# EasyEDA Pro project ProDoc_Schematic_Edge_Nexus_2026-03-18.epro

# Schematic Schematic Edge Nexus
Board Name: Board1; Create Date: 2026-02-27; Page Name: P1; Project Name: Edge Nexus; Schematic Name: Schematic Edge Nexus; Update Date: 2026-02-27; Company: EasyEDA.com; Page Size: A4; Version: V1.0
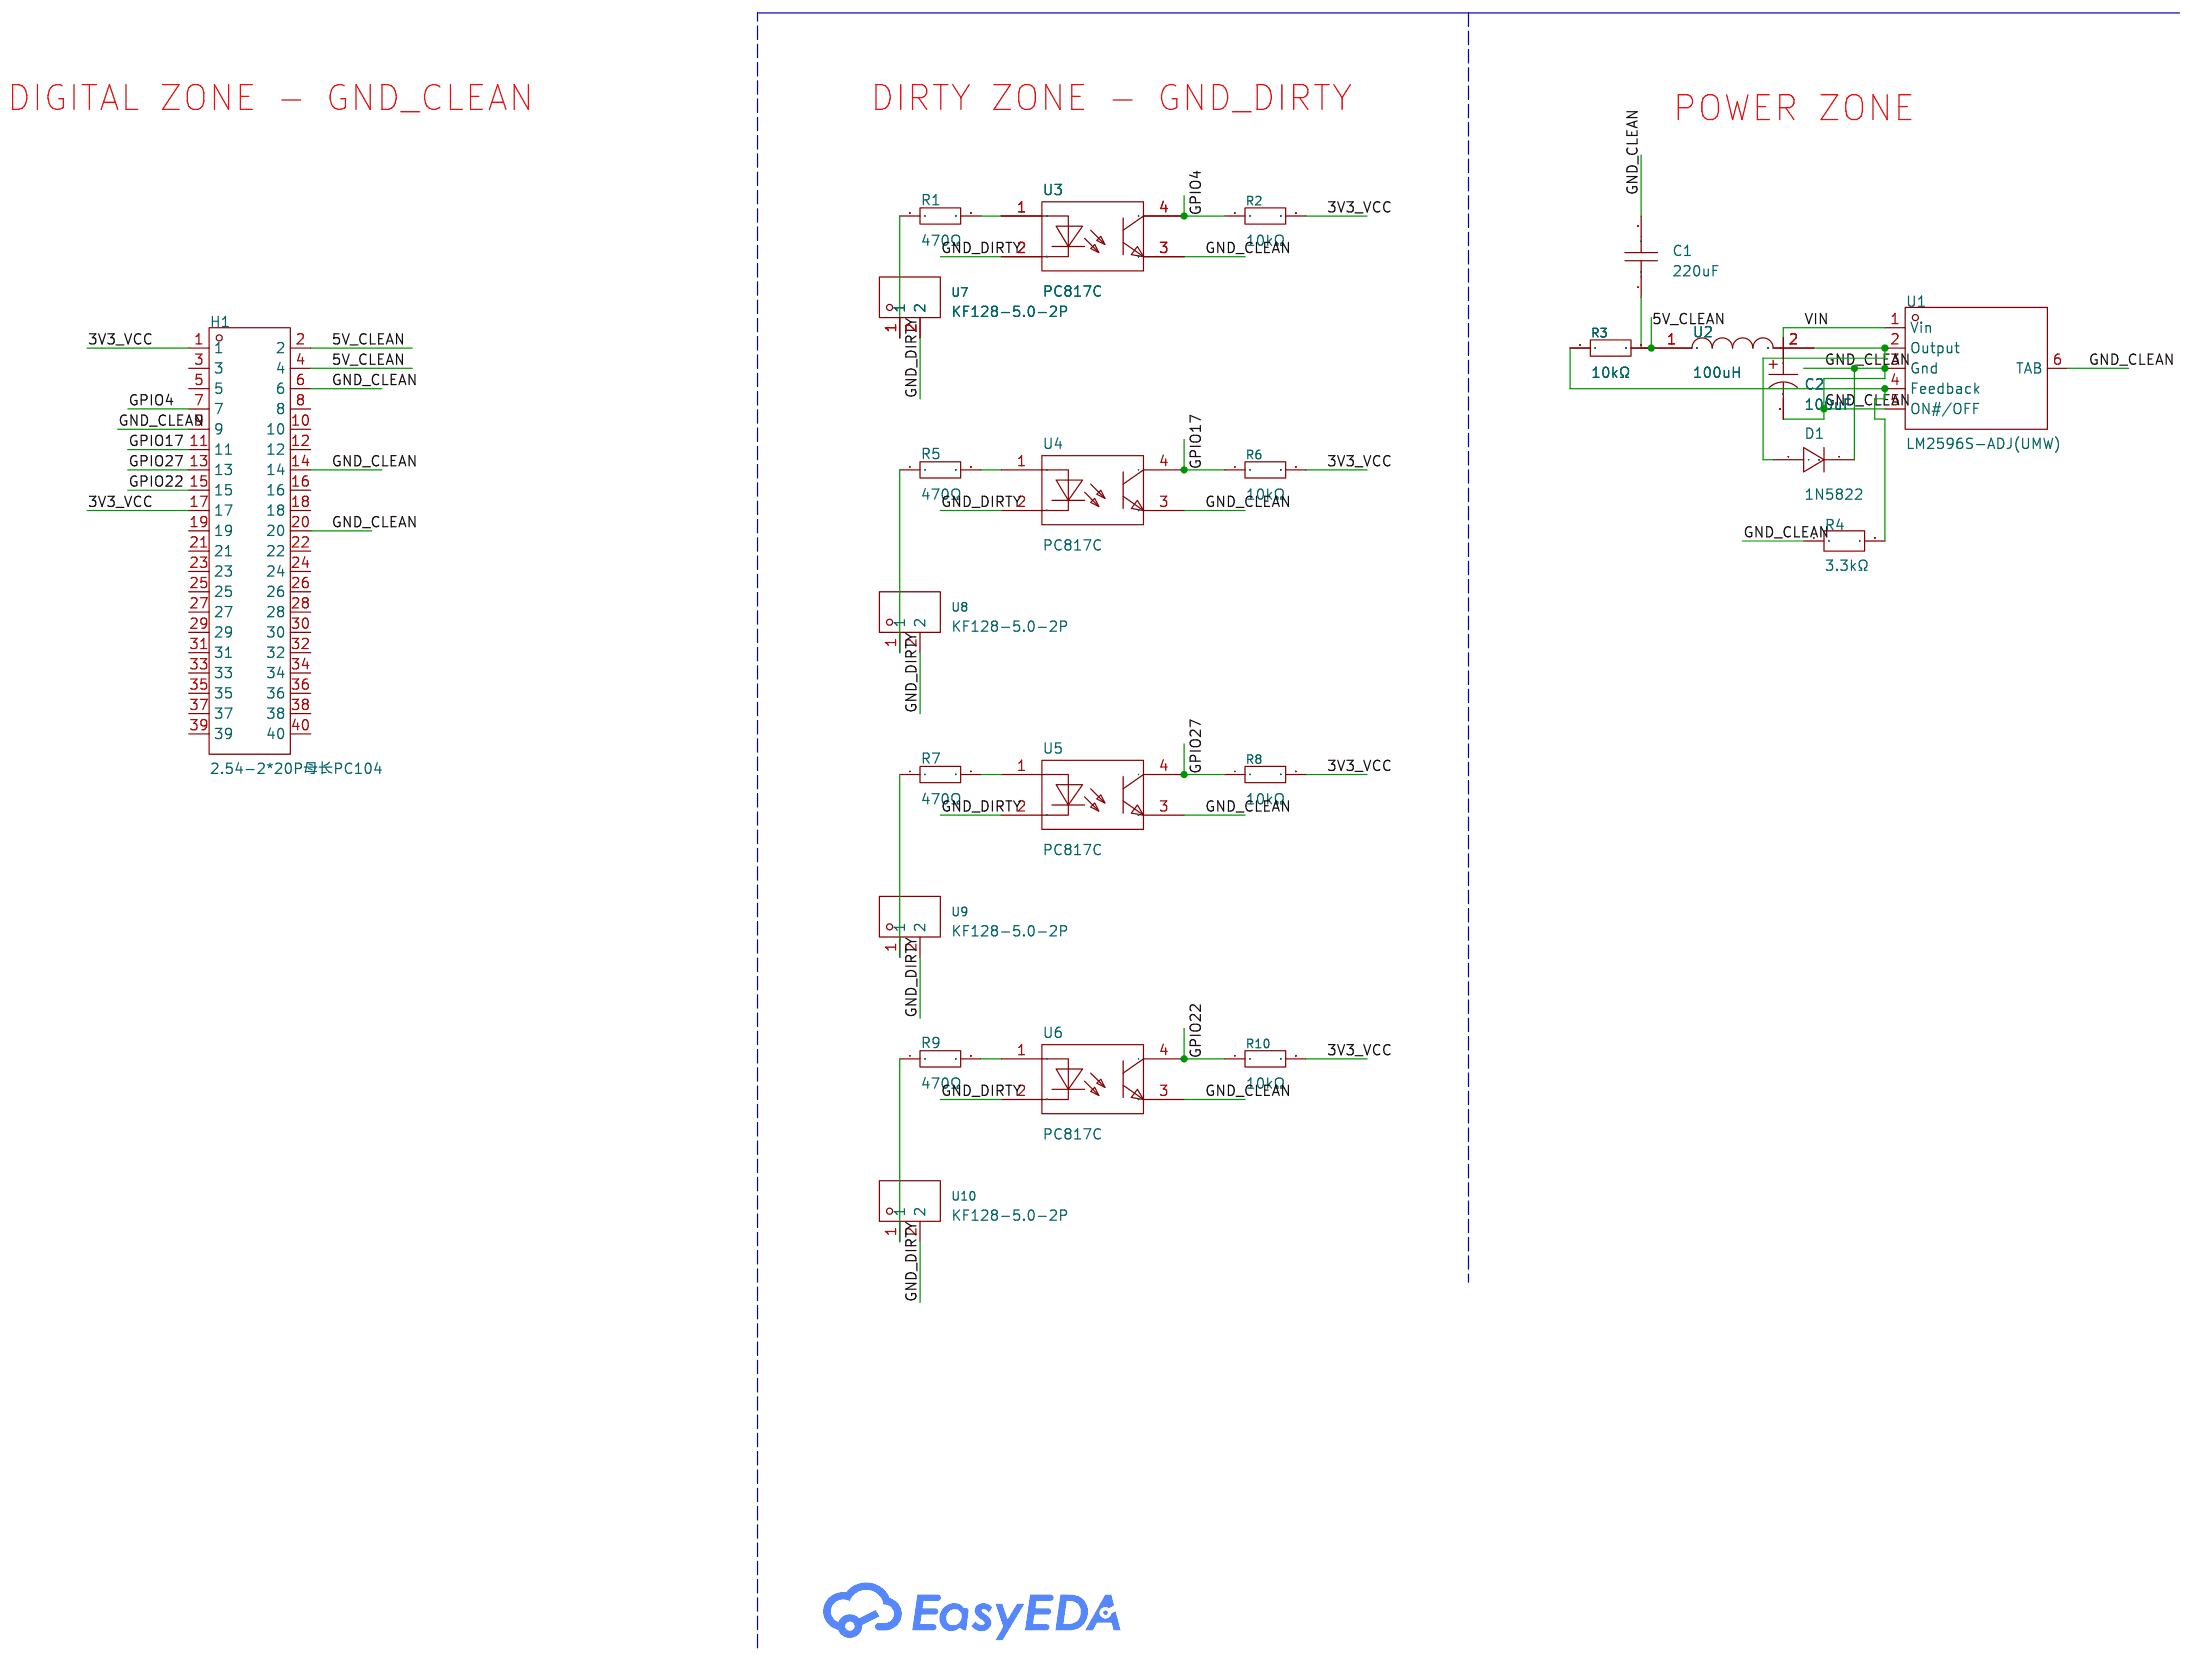
[diagram p0: schematic sheet]

## Parts
C1  220uF  [C1210]
C2  100uF  [CAP-TH_BD8.0-P3.50-D0.6-FD-H10.0]
D1  1N5822  [DO-201AD_BD5.3-L8.4-P12.50-D1.4-RD]
H1  2.54-2*20P母长PC104  [HDR-TH_40P-P2.54-V-F-R2-C20-S2.54-2]
R1  470Ω  [R0402]
R2  10kΩ  [R0402]
R3  10kΩ  [R0402]
R4  3.3kΩ  [RES-TH_BD4.5-L11.5-P15.50-D0.8]
R5  470Ω  [R0402]
R6  10kΩ  [R0402]
R7  470Ω  [R0402]
R8  10kΩ  [R0402]
R9  470Ω  [R0402]
R10  10kΩ  [R0402]
U1  LM2596S-ADJ(UMW)  [TO-263-5_L10.2-W8.9-P1.70-BR]
U2  100uH  [IND-SMD_L12.3-W12.3]
U3  PC817C  [OPTO-SMD-4_L4.6-W6.5-P2.54-LS10.3-TL]
U4  PC817C  [OPTO-SMD-4_L4.6-W6.5-P2.54-LS10.3-TL]
U5  PC817C  [OPTO-SMD-4_L4.6-W6.5-P2.54-LS10.3-TL]
U6  PC817C  [OPTO-SMD-4_L4.6-W6.5-P2.54-LS10.3-TL]
U7  KF128-5.0-2P  [CONN-TH_P5.00_KF128-5.0-2P]
U8  KF128-5.0-2P  [CONN-TH_P5.00_KF128-5.0-2P]
U9  KF128-5.0-2P  [CONN-TH_P5.00_KF128-5.0-2P]
U10  KF128-5.0-2P  [CONN-TH_P5.00_KF128-5.0-2P]

## Library data of the parts
C1 = CL32A227MQVNNNE: Capacitance:220uF Tolerance:±20% Tolerance:±20% Voltage Rating:6.3V Temperature Coefficient:X5R; LCSC Part Name: 220uF ±20% 6.3V; Supplier Part: C400951; Manufacturer: SAMSUNG(三星); Supplier Footprint: 1210; JLCPCB Part Class: Extended Part; Datasheet: https://item.szlcsc.com/datasheet/CL32A227MQVNNNE/385441.html; Supplier: LCSC; Tolerance: ±20%; Voltage Rating: 6.3V; Temperature Coefficient: X5R
C2 = 100uF35V8x11GF: Capacitance:100uF Tolerance:±20% Tolerance:±20% Voltage Rating:35V Ripple Current:640mA@100KHz Equivalent Series Resistance(ESR):170mΩ Pin Spacing:3.5mm Diameter:8mm Height - Seated (Max):11mm Lifetime:3000hrs@105℃ Operating Temperature:-40℃~+105℃ Operati; LCSC Part Name: 100uF ±20% 35V; Supplier Part: C49304899; Manufacturer: Econd(米朗电子); Supplier Footprint: 插件,D8xL11mm; JLCPCB Part Class: Extended Part; Datasheet: https://item.szlcsc.com/datasheet/100uF35V8x11GF/51766727.html; Supplier: LCSC; Tolerance: ±20%; Voltage Rating: 35V; Ripple Current: 640mA@100KHz; Equivalent Series Resistance(ESR): 170mΩ; Pin Spacing: 3.5mm; Diameter: 8mm; Height - Seated (Max): 11mm; Lifetime: 3000hrs@105℃; Operating Temperature: -40℃~+105℃
D1 = 1N5822_C82806: Diode Configuration:1 Independent Voltage - Forward(Vf@If):530mV Voltage - DC Reverse(Vr):40V Current - Rectified:3A Reverse Leakage Current (Ir):2mA@40V Operating Junction Temperature Range:-40℃~+125℃ Operating Junction Temperature Range:-40℃~+125℃ Non-R; LCSC Part Name: 电压:40V 电流:3A; Supplier Part: C82806; Manufacturer: LRC(乐山无线电); Supplier Footprint: DO-201AD; JLCPCB Part Class: Extended Part; Datasheet: https://item.szlcsc.com/datasheet/1N5822/83966.html; Supplier: LCSC; Diode Configuration: 1 Independent; Voltage - Forward(Vf@If): 530mV; Voltage - DC Reverse(Vr): 40V; Current - Rectified: 3A; Reverse Leakage Current (Ir): 2mA@40V; Operating Junction Temperature Range: -40℃~+125℃; Non-Repetitive Peak Forward Surge Current: 80A
H1 = 2.54-2*20P母长PC104: Holes Structure:2x20P Pitch:2.54mm Row Spacing:2.54mm Circular Hole / Square Hole:Square Hole Mounting Type:Through Hole Number of Rows:2 Number of Positions:40P Current Rating:3A Holes Direction:Top Insulation Height:8.3mm Contact Material:Brass Contact; LCSC Part Name: 2x20P 间距:2.54mm 直插; Supplier Part: C35165; Manufacturer: BOOMELE(博穆精密); Supplier Footprint: 插件,P=2.54mm; Datasheet: https://item.szlcsc.com/datasheet/2.54-2*20P%25E6%25AF%258D%25E9%2595%25BFPC104/36136.html; Supplier: LCSC; Holes Structure: 2x20P; Pitch: 2.54mm; Row Spacing: 2.54mm; Circular Hole / Square Hole: Square Hole; Mounting Type: Through Hole; Number of Rows: 2; Number of Positions: 40P; Current Rating: 3A; Holes Direction: Top; Insulation Height: 8.3mm; Contact Material: Brass; PIN Length: 12.3mm
R1 R5 R7 R9 = RC0402JR-07470RL: Type:Thick Film Resistors Resistance: Tolerance:±5% Tolerance:±5% Power(Watts): Overload Voltage (Max): Temperature Coefficient:±100ppm/℃ Temperature Coefficient:±100ppm/℃ Operating Temperature Range:-55℃~+155℃ Operating Temperature Range:-55℃~+155℃; LCSC Part Name: 厚膜电阻 470Ω ±5% 62.5mW; Supplier Part: C114949; Manufacturer: YAGEO(国巨); Supplier Footprint: 0402; Datasheet: https://atta.szlcsc.com/upload/public/pdf/source/20180821/C275644_0D56F95EFF785E7D9A1FEF436B37DA78.pdf; Supplier: LCSC; Type: Thick Film Resistors; Tolerance: ±5%; Temperature Coefficient: ±100ppm/℃; Operating Temperature Range: -55℃~+155℃
R2 R3 R6 R8 R10 = TR0402D10K0Q1025Z: Type:Thin Film Resistor Resistance: Tolerance:±0.5% Tolerance:±0.5% Power(Watts): Overload Voltage (Max): Temperature Coefficient:±25ppm/℃ Temperature Coefficient:±25ppm/℃ Operating Temperature Range:-55℃~+155℃ Operating Temperature Range:-55℃~+155℃; LCSC Part Name: 薄膜电阻 10kΩ ±0.5% 63mW; Supplier Part: C149898; Manufacturer: EVER OHMS(天二科技); Supplier Footprint: 0402; JLCPCB Part Class: Extended Part; Datasheet: https://atta.szlcsc.com/upload/public/pdf/source/20190527/C149900_32B1354086E9F6A772108AB7B2B7A514.pdf; Supplier: LCSC; Type: Thin Film Resistor; Tolerance: ±0.5%; Temperature Coefficient: ±25ppm/℃; Operating Temperature Range: -55℃~+155℃
R4 = MF1W-3.3KΩ±1%T: Type:Metal Film Resistors Resistance: Tolerance:±1% Tolerance:±1% Temperature Coefficient:±200ppm/℃ Temperature Coefficient:±200ppm/℃; LCSC Part Name: 金属膜电阻 3.3kΩ ±1%; Supplier Part: C714109; Manufacturer: 华星机电; Supplier Footprint: 插件,D4.5xL11.5mm; JLCPCB Part Class: Extended Part; Datasheet: https://atta.szlcsc.com/upload/public/pdf/source/20200731/C713882_AE8EB1102749D7E4FB4FB13DC898C429.pdf; Supplier: LCSC; Type: Metal Film Resistors; Tolerance: ±1%; Temperature Coefficient: ±200ppm/℃
U1 = LM2596S-ADJ(UMW): Function:Buck Voltage - Supply:40V Voltage - Supply:40V Output Voltage:1.2V~37V Output Voltage:1.2V~37V Output Current:3A Frequency - Switching:150kHz Frequency - Switching:150kHz Operating Temperature:-40℃~+125℃@(TA) Operating Temperature:-40℃~+125℃@(TA); LCSC Part Name: 3A降压稳压器; Supplier Part: C347423; Manufacturer: UMW(友台半导体); Supplier Footprint: TO-263-5; JLCPCB Part Class: Extended Part; Datasheet: https://item.szlcsc.com/datasheet/LM2596S-ADJ(UMW)/324083.html; Supplier: LCSC; Function: Buck; Voltage - Supply: 40V; Output Voltage: 1.2V~37V; Output Current: 3A; Frequency - Switching: 150kHz; Operating Temperature: -40℃~+125℃@(TA); Synchronous Rectifier: No; Number of Outputs: 1; Topology: Buck; Quiescent Current: 80uA; Switch tube (built-in/external): Built-In; Output Type: Adjustable
U2 = CYH127-100UH: Inductance:100uH Tolerance:±20% Tolerance:±20% Current Rating:1.7A Current - Saturation (Isat):- DC Resistance(DCR):220mΩ Q @ Frequency:- Frequency - Self Resonant:- Ratings:-; LCSC Part Name: 100uH ±20%; Supplier Part: C2929505; Manufacturer: SHOU HAN(首韩); Supplier Footprint: SMD,12.3x12.3mm; JLCPCB Part Class: Extended Part; Datasheet: https://item.szlcsc.com/datasheet/CYH127-100UH/3264937.html; Supplier: LCSC; Tolerance: ±20%; Current Rating: 1.7A; DC Resistance(DCR): 220mΩ
U3-U6 = PC817C_C3025164: Input type:DC Output Type:Phototransistor Voltage - Forward(Vf):1.2V Output Current:50mA Isolation Voltage(Vrms):5kV Reverse Voltage:6V Load Voltage:35V Number of Outputs:1 Vce Saturation(VCE(sat)):100mV@1mA,20mA Rise time:6us@2mA,100Ω Fall time:5us Opera; LCSC Part Name: C档 光电晶体管光电耦合器; Supplier Part: C3025164; Manufacturer: GOODWORK(固得沃克); Supplier Footprint: SMD-4P; JLCPCB Part Class: Extended Part; Datasheet: https://item.szlcsc.com/datasheet/PC817C/3553773.html; Supplier: LCSC; Input type: DC; Output Type: Phototransistor; Voltage - Forward(Vf): 1.2V; Output Current: 50mA; Isolation Voltage(Vrms): 5kV; Reverse Voltage: 6V; Load Voltage: 35V; Number of Outputs: 1; Vce Saturation(VCE(sat)): 100mV@1mA,20mA; Rise time: 6us@2mA,100Ω; Fall time: 5us; Operating Temperature: -55℃~+110℃; Current Transfer Ratio (CTR) Minimum: 200%; Current Transfer Ratio (CTR) Maximum/Saturation Value: 400%; Forward Current(If): 50mA
U7-U10 = KF128-5.0-2P: Number of Positions or Pins:1x2P Pitch:5mm Color:Green Mounting Type:Through Hole Number of Pins:2P Number of Rows:1 Number of PINs Per Row:2 Current Rating:24A Voltage Rating (Max):250V Wire Gauge - AWG:12~22 Wire Gauge - mm2:2.5 Wire Gauge - mm2:2.5 Ope; LCSC Part Name: 1x2P 5mm 直插 排数:1 每排P数:2; Supplier Part: C474950; Manufacturer: KEFA(科发); Supplier Footprint: 插件,P=5mm; Datasheet: https://item.szlcsc.com/datasheet/KF128-5.0-2P/481568.html; Supplier: LCSC; Number of Positions or Pins: 1x2P; Pitch: 5mm; Color: Green; Mounting Type: Through Hole; Number of Pins: 2P; Number of Rows: 1; Number of PINs Per Row: 2; Current Rating: 24A; Voltage Rating (Max): 250V; Wire Gauge - AWG: 12~22; Wire Gauge - mm2: 2.5; Operating Temperature: -40℃~+105℃

## Nets
3V3_VCC: H1.1 H1.17 R2.2 R6.2 R8.2 R10.2
5V_CLEAN: C1.1 H1.2 H1.4 R3.2 U2.1
GND_CLEAN: C1.2 C2.2 D1.1(C) H1.6 H1.9 H1.14 H1.20 R4.1 U1.3(Gnd) U1.5(ON#/OFF) U1.6(TAB) U3.3 U4.3 U5.3 U6.3
GND_DIRTY: U3.2 U4.2 U5.2 U6.2 U7.2 U8.2 U9.2 U10.2
VIN: C2.1 U1.1(Vin)
GPIO4: H1.7 R2.1 U3.4
GPIO17: H1.11 R6.1 U4.4
GPIO22: H1.15 R10.1 U6.4
GPIO27: H1.13 R8.1 U5.4
Net-(D1-2): D1.2(A) U1.2(Output) U2.2
Net-(R1-1): R1.1 U7.1
Net-(R1-2): R1.2 U3.1
Net-(R3-1): R3.1 R4.2 U1.4(Feedback)
Net-(R5-1): R5.1 U8.1
Net-(R5-2): R5.2 U4.1
Net-(R7-1): R7.1 U9.1
Net-(R7-2): R7.2 U5.1
Net-(R9-1): R9.1 U10.1
Net-(R9-2): R9.2 U6.1

Not connected (* = marked no-connect by the designer): H1 3 5 8 10 12 16 18 19 21 22 23 24 25 26 27 28 29 30 31 32 33 34 35 36 37 38 39 40

## Notes on the sheet
- DIGITAL ZONE - GND_CLEAN
- DIRTY ZONE - GND_DIRTY
- POWER ZONE
